# EAGLE design robot_balance (EAGLE 7.2.0)
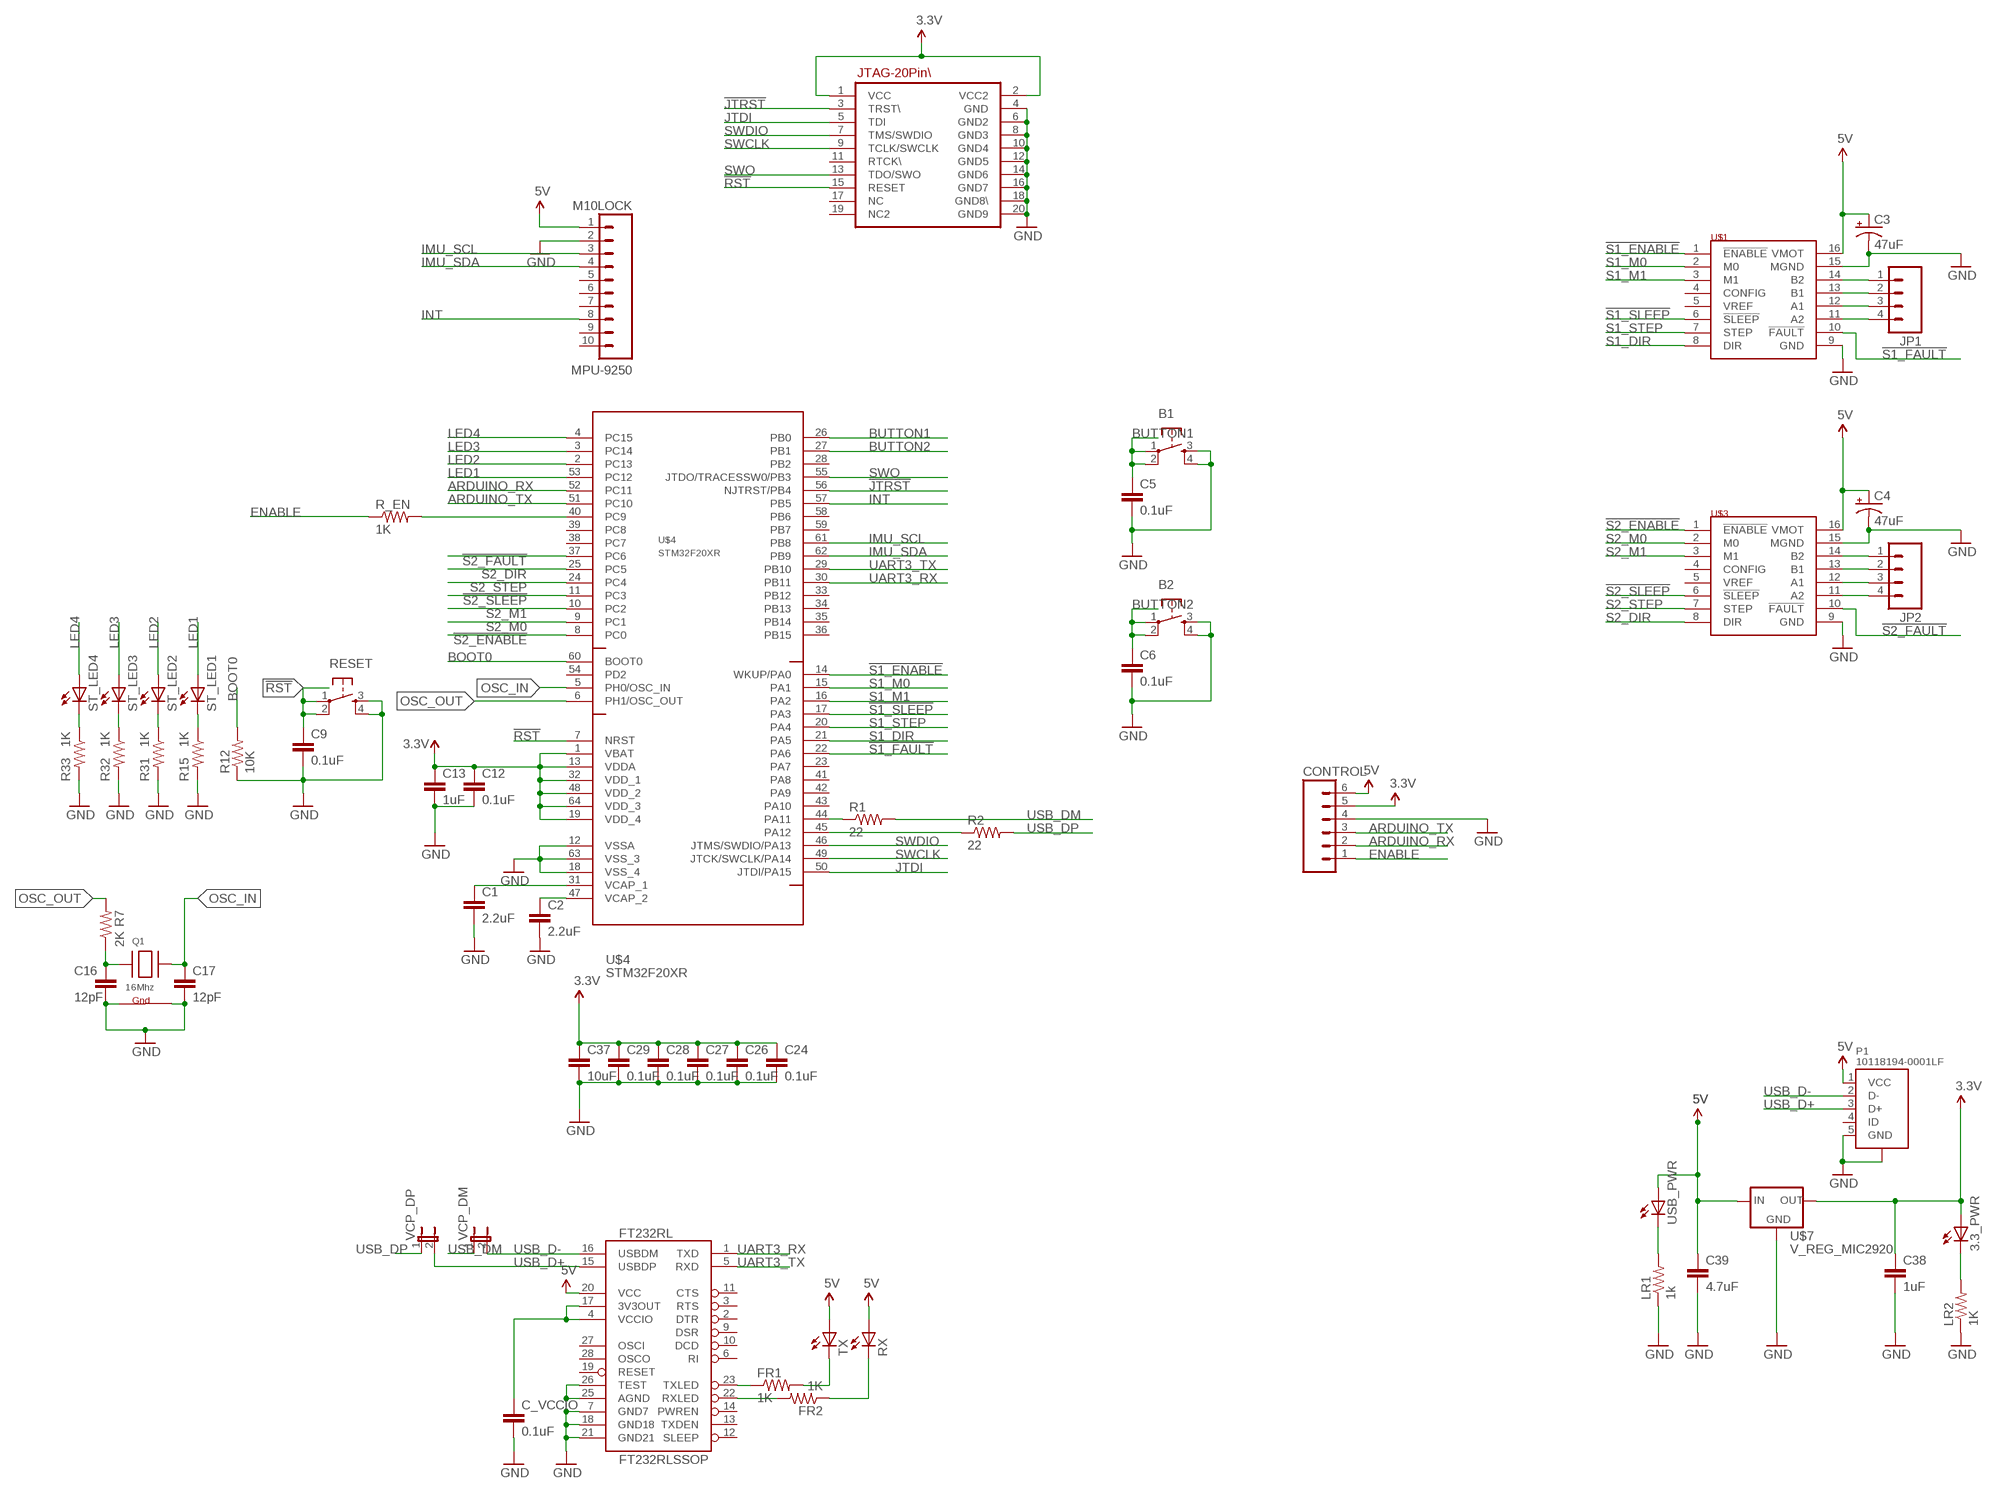
[diagram p0: schematic, sheet 1]

## Parts
3.3_PWR  LEDCHIPLED_0805  [CHIPLED_0805]
B1  TAC_SWITCHSMD  [TACTILE-SWITCH-SMD]
B2  TAC_SWITCHSMD  [TACTILE-SWITCH-SMD]
C1  2.2uF  2.2UF-25V-+80/-20(0805)  [0805]
C2  2.2uF  2.2UF-25V-+80/-20(0805)  [0805]
C3  47uF  47UF-10V-10%(TANT)  [EIA3528]
C4  47uF  47UF-10V-10%(TANT)  [EIA3528]
C5  0.1uF  2.2UF-25V-+80/-20(0805)  [0805]
C6  0.1uF  2.2UF-25V-+80/-20(0805)  [0805]
C9  0.1uF  2.2UF-25V-+80/-20(0805)  [0805]
C12  0.1uF  2.2UF-25V-+80/-20(0805)  [0805]
C13  1uF  2.2UF-25V-+80/-20(0805)  [0805]
C16  12pF  CAP0805  [0805]
C17  12pF  CAP0805  [0805]
C24  0.1uF  2.2UF-25V-+80/-20(0805)  [0805]
C26  0.1uF  2.2UF-25V-+80/-20(0805)  [0805]
C27  0.1uF  2.2UF-25V-+80/-20(0805)  [0805]
C28  0.1uF  2.2UF-25V-+80/-20(0805)  [0805]
C29  0.1uF  2.2UF-25V-+80/-20(0805)  [0805]
C37  10uF  2.2UF-25V-+80/-20(0805)  [0805]
C38  1uF  22UF-6.3V-20%(0805)  [0805]
C39  4.7uF  22UF-6.3V-20%(0805)  [0805]
C_VCCIO  0.1uF  CAP0603-CAP  [0603-CAP]
CONTROL  M06POLAR_LOCK  [MOLEX-1X6_LOCK]
FR1  1K  RESISTOR0603-RES  [0603-RES]
FR2  1K  RESISTOR0603-RES  [0603-RES]
FT232RL  FT232RLSSOP  [SSOP28DB]
JP1  M04POLAR_LOCK  [MOLEX-1X4_LOCK]
JP2  M04POLAR_LOCK  [MOLEX-1X4_LOCK]
LR1  1k  RESISTOR0805-RES  [0805]
LR2  1K  RESISTOR0805-RES  [0805]
MPU-9250  M10LOCK  [1X10_LOCK]
P1  10118194-0001LF  [10118194-0001LF]
Q1  16Mhz  XTAL-4-3225  [NX3225]
R1  22  RESISTOR0805-RES  [0805]
R2  22  RESISTOR0805-RES  [0805]
R7  2K  RESISTOR0805-RES  [0805]
R12  10K  RESISTOR0805-RES  [0805]
R15  1K  RESISTOR0805-RES  [0805]
R31  1K  RESISTOR0805-RES  [0805]
R32  1K  RESISTOR0805-RES  [0805]
R33  1K  RESISTOR0805-RES  [0805]
R_EN  1K  RESISTOR0603-RES  [0603-RES]
RESET  TAC_SWITCHSMD  [TACTILE-SWITCH-SMD]
RX  LEDCHIPLED_0805  [CHIPLED_0805]
ST_LED1  LEDCHIPLED_0805  [CHIPLED_0805]
ST_LED2  LEDCHIPLED_0805  [CHIPLED_0805]
ST_LED3  LEDCHIPLED_0805  [CHIPLED_0805]
ST_LED4  LEDCHIPLED_0805  [CHIPLED_0805]
TX  LEDCHIPLED_0805  [CHIPLED_0805]
U$1  POLOLU_DRV8834  [POLOLU_DRV8834]
U$2  JTAG_20PIN  [2X10]
U$3  POLOLU_DRV8834  [POLOLU_DRV8834]
U$4  STM32F20XR  [LQFP64]
U$7  V_REG_MIC2920  [SOT223]
USB_PWR  LEDCHIP-LED0805  [CHIP-LED0805]
VCP_DM  JUMPER-2SMD-NO  [SJ_2S-NO]
VCP_DP  JUMPER-2SMD-NO  [SJ_2S-NO]

## Nets
3.3V [power2]: 3.3_PWR.A C12.1 C13.1 C24.1 C26.1 C27.1 C28.1 C29.1 C37.1 C38.1 CONTROL.5 U$2.1(VCC) U$2.2(VCC2) U$4.1(VBAT) U$4.13(VDDA) U$4.19(VDD_4) U$4.32(VDD_1) U$4.48(VDD_2) U$4.64(VDD_3) U$7.3(OUT)
5V [power3]: C3.A(+) C4.A(+) C39.1 CONTROL.6 FT232RL.20(VCC) MPU-9250.1 P1.1(VCC) RX.A TX.A U$1.16(VMOT) U$3.16(VMOT) U$7.1(IN) USB_PWR.A
!JTRST: U$2.3(TRST\) U$4.56(NJTRST/PB4)
!RST: C9.1 RESET.1 RESET.2 U$2.15(RESET) U$4.7(NRST)
!S1_ENABLE: U$1.1(!ENABLE) U$4.14(WKUP/PA0)
!S1_FAULT: U$1.10(!FAULT) U$4.22(PA6)
!S1_SLEEP: U$1.6(!SLEEP) U$4.17(PA3)
!S2_ENABLE: U$3.1(!ENABLE) U$4.8(PC0)
!S2_FAULT: U$3.10(!FAULT) U$4.37(PC6)
!S2_SLEEP: U$3.6(!SLEEP) U$4.11(PC3)
ARDUINO_RX [data]: CONTROL.2 U$4.52(PC11)
ARDUINO_TX [data]: CONTROL.3 U$4.51(PC10)
BOOT0: R12.2 U$4.60(BOOT0)
BUTTON1: B1.1 B1.2 C5.1 U$4.26(PB0)
BUTTON2: B2.1 B2.2 C6.1 U$4.27(PB1)
ENABLE: CONTROL.1 R_EN.1
GND [power2]: B1.3 B1.4 B2.3 B2.4 C1.2 C2.2 C3.C(-) C4.C(-) C5.2 C6.2 C9.2 C12.2 C13.2 C16.2 C17.2 C24.2 C26.2 C27.2 C28.2 C29.2 C37.2 C38.2 C39.2 C_VCCIO.2 CONTROL.4 FT232RL.7(GND7) FT232RL.18(GND18) FT232RL.21(GND21) FT232RL.25(AGND) FT232RL.26(TEST) LR1.1 LR2.1 MPU-9250.2 P1.5(GND) P1.M1(SHIELD) P1.M2(SHIELD) P1.M3(SHIELD) P1.M4(SHIELD) Q1.2(G2) Q1.4(G1) R12.1 R15.2 R31.2 R32.2 R33.2 RESET.3 RESET.4 U$1.9(GND) U$1.15(MGND) U$2.4(GND) U$2.6(GND2) U$2.8(GND3) U$2.10(GND4) U$2.12(GND5) U$2.14(GND6) U$2.16(GND7) U$2.18(GND8\) U$2.20(GND9) U$3.9(GND) U$3.15(MGND) U$4.12(VSSA) U$4.18(VSS_4) U$4.63(VSS_3) U$7.2(GND)
IMU_SCL: MPU-9250.3 U$4.61(PB8)
IMU_SDA: MPU-9250.4 U$4.62(PB9)
INT: MPU-9250.8 U$4.57(PB5)
JTDI: U$2.5(TDI) U$4.50(JTDI/PA15)
LED1: ST_LED1.A U$4.53(PC12)
LED2: ST_LED2.A U$4.2(PC13)
LED3: ST_LED3.A U$4.3(PC14)
LED4: ST_LED4.A U$4.4(PC15)
N$1 [motor]: JP1.1 U$1.14(B2)
N$2: C1.1 U$4.31(VCAP_1)
N$3 [motor]: JP1.2 U$1.13(B1)
N$4 [motor]: JP1.3 U$1.12(A1)
N$5 [motor]: JP1.4 U$1.11(A2)
N$6: R_EN.2 U$4.40(PC9)
N$7: R1.1 U$4.44(PA11)
N$8 [data]: FR1.1 FT232RL.23(TXLED)
N$9 [data]: FR1.2 TX.C
N$10 [data]: FR2.2 FT232RL.22(RXLED)
N$11 [data]: FR2.1 RX.C
N$12: C2.1 U$4.47(VCAP_2)
N$13 [data]: C_VCCIO.1 FT232RL.4(VCCIO) FT232RL.17(3V3OUT)
N$14: R2.1 U$4.45(PA12)
N$18 [data]: 3.3_PWR.C LR2.2
N$19 [data]: LR1.2 USB_PWR.C
N$21 [motor]: JP2.1 U$3.14(B2)
N$23 [motor]: JP2.2 U$3.13(B1)
N$24 [motor]: JP2.3 U$3.12(A1)
N$25 [motor]: JP2.4 U$3.11(A2)
N$41 [data]: R15.1 ST_LED1.C
N$43 [data]: R31.1 ST_LED2.C
N$45: R32.1 ST_LED3.C
N$47 [data]: R33.1 ST_LED4.C
N$122: C16.1 Q1.1(X1) R7.1
OSC_IN: C17.1 Q1.3(X2) U$4.5(PH0/OSC_IN)
OSC_OUT: R7.2 U$4.6(PH1/OSC_OUT)
S1_DIR: U$1.8(DIR) U$4.21(PA5)
S1_M0: U$1.2(M0) U$4.15(PA1)
S1_M1: U$1.3(M1) U$4.16(PA2)
S1_STEP: U$1.7(STEP) U$4.20(PA4)
S2_DIR: U$3.8(DIR) U$4.25(PC5)
S2_M0: U$3.2(M0) U$4.9(PC1)
S2_M1: U$3.3(M1) U$4.10(PC2)
S2_STEP: U$3.7(STEP) U$4.24(PC4)
SWCLK: U$2.9(TCLK/SWCLK) U$4.49(JTCK/SWCLK/PA14)
SWDIO: U$2.7(TMS/SWDIO) U$4.46(JTMS/SWDIO/PA13)
SWO: U$2.13(TDO/SWO) U$4.55(JTDO/TRACESSW0/PB3)
UART3_RX: FT232RL.1(TXD) U$4.30(PB11)
UART3_TX: FT232RL.5(RXD) U$4.29(PB10)
USB_D+ [data]: FT232RL.15(USBDP) P1.3(D+) VCP_DP.2
USB_D- [data]: FT232RL.16(USBDM) P1.2(D-) VCP_DM.2
USB_DM: R1.2 VCP_DM.1
USB_DP: R2.2 VCP_DP.1
Unconnected: FT232RL.2(DTR) FT232RL.3(RTS) FT232RL.6(RI) FT232RL.9(DSR) FT232RL.10(DCD) FT232RL.11(CTS) FT232RL.12(SLEEP) FT232RL.13(TXDEN) FT232RL.14(PWREN) FT232RL.19(RESET) FT232RL.27(OSCI) FT232RL.28(OSCO) MPU-9250.5 MPU-9250.6 MPU-9250.7 MPU-9250.9 MPU-9250.10 P1.4(ID) U$1.4(CONFIG) U$1.5(VREF) U$2.11(RTCK\) U$2.17(NC) U$2.19(NC2) U$3.4(CONFIG) U$3.5(VREF) U$4.23(PA7) U$4.28(PB2) U$4.33(PB12) U$4.34(PB13) U$4.35(PB14) U$4.36(PB15) U$4.38(PC7) U$4.39(PC8) U$4.41(PA8) U$4.42(PA9) U$4.43(PA10) U$4.54(PD2) U$4.58(PB6) U$4.59(PB7)

## Library data of the parts
3.3_PWR RX ST_LED1-ST_LED4 TX USB_PWR = adafruit:LED: LED OSRAM: - CHIPLED LG R971, LG N971, LY N971, LG Q971, LY Q971, LO R971, LY R971 LH N974, LH R974 LS Q976, LO Q976, LY Q976 LO Q996 - Hyper CHIPLED LW Q18S LB Q993, LB Q99A, LB R99A - SideLED LS A670, LO A670, LY A670, LG A670, LP A670 LB A673, LV A673, LT A673, LW A673 LH A674 LY A675 LS A676, LA A676, LO A676, LY A676, LW A676 LS A679, LY A679, LG A679 - Hyper Micro SIDELED® LS Y876, LA Y876, LO Y876, LY Y876 LT Y87S - SmartLED LW L88C, LW L88S LB L89C, LB L89S, LG L890 LS L89K, LO L89K, LY L89K LS L896, LA L896, LO L896, LY L896 - TOPLED LS T670, LO T670, LY T670, LG T670, LP T670 LSG T670, LSP T670, LSY T670, LOP T670, LYG T670 LG T671, LOG T671, LSG T671 LB T673, LV T673, LT T673, LW T673 LH T674 LS T676, LA T676, LO T676, LY T676, LB T676, LH T676, LSB T676, LW T676 LB T67C, LV T67C, LT T67C, LS T67K, LO T67K, LY T67K, LW E67C LS E67B, LA E67B, LO E67B, LY E67B, LB E67C, LV E67C, LT E67C LW T67C LS T679, LY T679, LG T679 LS T770, LO T770, LY T770, LG T770, LP T770 LB T773, LV T773, LT T773, LW T773 LH T774 LS E675, LA E675, LY E675, LS T675 LS T776, LA T776, LO T776, LY T776, LB T776 LHGB T686 LT T68C, LB T68C - Hyper Mini TOPLED® LB M676 - Mini TOPLED Santana® LG M470 LS M47K, LO M47K, LY M47K Source: http://www.osram.convergy.de/
B1 B2 RESET = SparkFun-Electromechanical:TAC_SWITCH: Momentary Switch Button commonly used for reset or general input. Spark Fun Electronics SKU : COM-00097 SMT- SWCH-08247
C1 C2 = SparkFun-Capacitors:2.2UF-25V-+80/-20(0805): CAP-11624; PROD_ID: CAP-11624
C3 C4 = SparkFun-Capacitors:47UF-10V-10%(TANT): CAP-08310 47uF Tantalum SMT 10V 10% (EIA-3528); PROD_ID: CAP-08310
C5 C6 C9 C12 C13 C24 C26-C29 C37 = SparkFun-Capacitors:2.2UF-25V-+80/-20(0805): CAP-11624; PROD_ID: CAP-11624; VALUE: 2.2uF
C16 C17 C_VCCIO = SparkFun-Capacitors:CAP: Capacitor Standard 0603 ceramic capacitor, and 0.1" leaded capacitor.
C38 C39 = SparkFun-Capacitors:22UF-6.3V-20%(0805): CAP-08402 Ceramic; PROD_ID: CAP-08402; VALUE: 22uF
CONTROL = SparkFun-Connectors:M06: Header 6 Standard 6-pin 0.1" header. Use with straight break away headers (SKU : PRT-00116), right angle break away headers (PRT-00553), swiss pins (PRT-00743), machine pins (PRT-00117), and female headers (PRT-00115). Molex polarized connector foot print use with SKU : PRT-08094 with associated crimp pins and housings. NOTES ON THE VARIANTS LOCK and LOCK_LONGPADS... This footprint was designed to help hold the alignment of a through-hole component (i.e. 6-pin header) while soldering it into place. You may notice that each hole has been shifted either up or down by 0.005 of an inch from it's more standard position (which is a perfectly straight line). This slight alteration caused the pins (the squares in the middle) to touch the edges of the holes. Because they are alternating, it causes a "brace" to hold the component in place. 0.005 has proven to be the perfect amount of "off-center" position when using our standard breakaway headers. Although looks a little odd when you look at the bare footprint, once you have a header in there, the alteration is very hard to notice. Also,if you push a header all the way into place, it is covered up entirely on the bottom side. This idea of altering the position of holes to aid alignment will be further integrated into the Sparkfun Library for other footprints. It can help hold any component with 3 or more connection pins.
FR1 FR2 R1 R2 R12 R_EN = SparkFun-Passives:RESISTOR: Resistor Basic schematic elements and footprints for 0603, 1206, and PTH resistors.
FT232RL = SparkFun-DigitalIC:FT232RL: USB UART FT232RL 4th Generation USB UART (USB <-> Serial) Controller. Spark Fun Electronics SKU : COM-00650 Production SKU IC-00870; PROD_ID: IC-00870
JP1 JP2 = SparkFun-Connectors:M04: Header 4 Standard 4-pin 0.1" header. Use with straight break away headers (SKU : PRT-00116), right angle break away headers (PRT-00553), swiss pins (PRT-00743), machine pins (PRT-00117), and female headers (PRT-00115). Molex polarized connector foot print use with SKU : PRT-08231 with associated crimp pins and housings. 1MM SMD Version SKU: PRT-10208
LR1 LR2 R7 R15 R31-R33 = SparkFun-Resistors:RESISTOR: Resistor Basic schematic elements and footprints for 0603, 1206, and PTH resistors.
MPU-9250 = SparkFun-Connectors:M10: Header 10 Standard 10-pin 0.1" header. Use with straight break away headers (SKU : PRT-00116), right angle break away headers (PRT-00553), swiss pins (PRT-00743), machine pins (PRT-00117), and female headers (PRT-00115).
P1 = usb_micro:10118194-0001LF: CONN USB MICRO B RECPT SMT R/A; DISTPARTNO: 609-4618-1-ND; DISTRIBUTOR: Digikey; MANPARTNO: 10118194-0001LF; MANUFACTURER: FCI; PARTNO: GT10040; POPULATE: yes
Q1 = adafruit:XTAL-4: Classic 4-pin 3.2 x 2.5mm crystal
U$1 U$3 = pololu:POLOLU_DRV8834
U$2 = JonathanLukas:JTAG_20PIN
U$4 = stm32F:STM32F20XR
U$7 = SparkFun-PowerIC:V_REG_MIC2920: MIC2920A (http://www.micrel.com/_PDF/mic2920.pdf) - 400mA output LDO Regulator
VCP_DM VCP_DP = SparkFun-Retired:JUMPER-2: Jumper Basic 0.1" spaced jumper. Use with breakaway headers.

## Net classes
0 default: width 0.203 mm
1 data: width 0.152 mm
2 power: width 0.635 mm, clearance 0.152 mm
3 power2: width 0.305 mm, clearance 0.152 mm
4 motor: width 0.813 mm
5 power3: width 0.457 mm

## Board
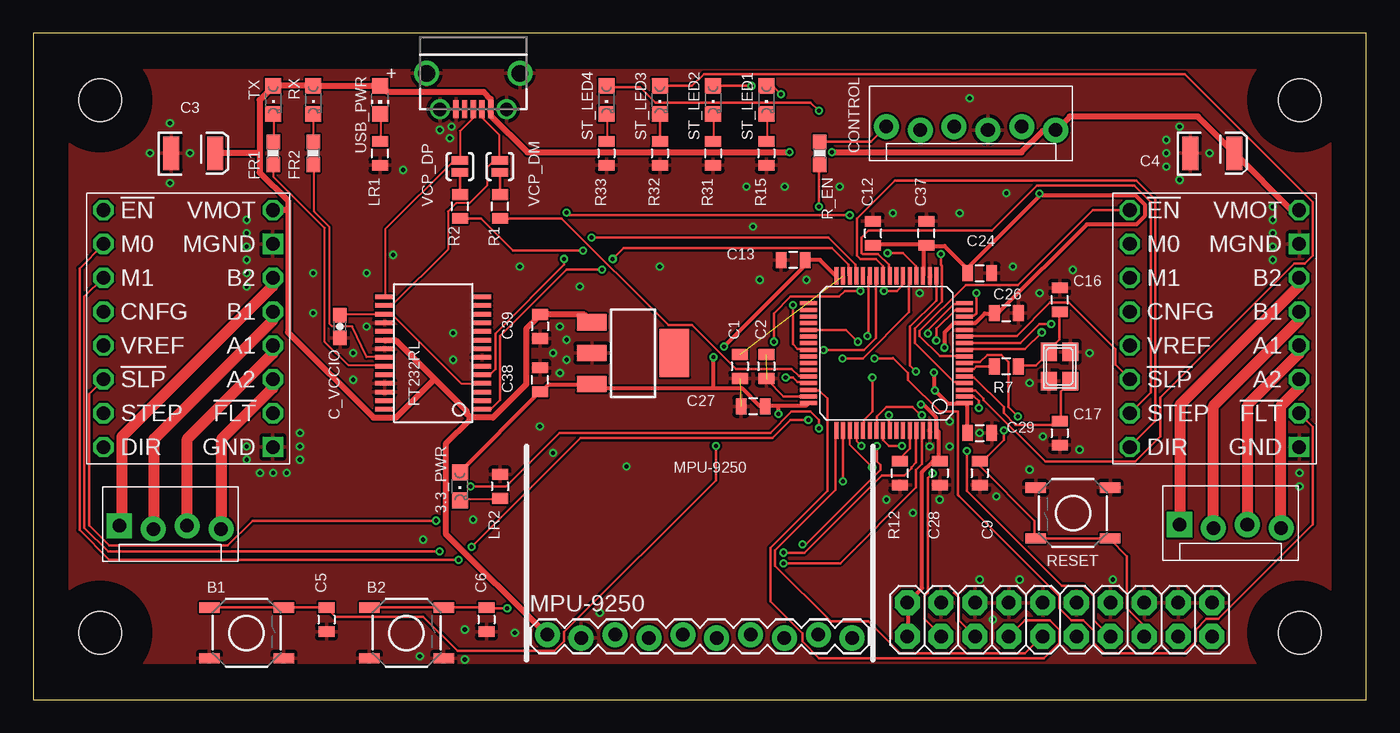
[diagram p1: board, top side]
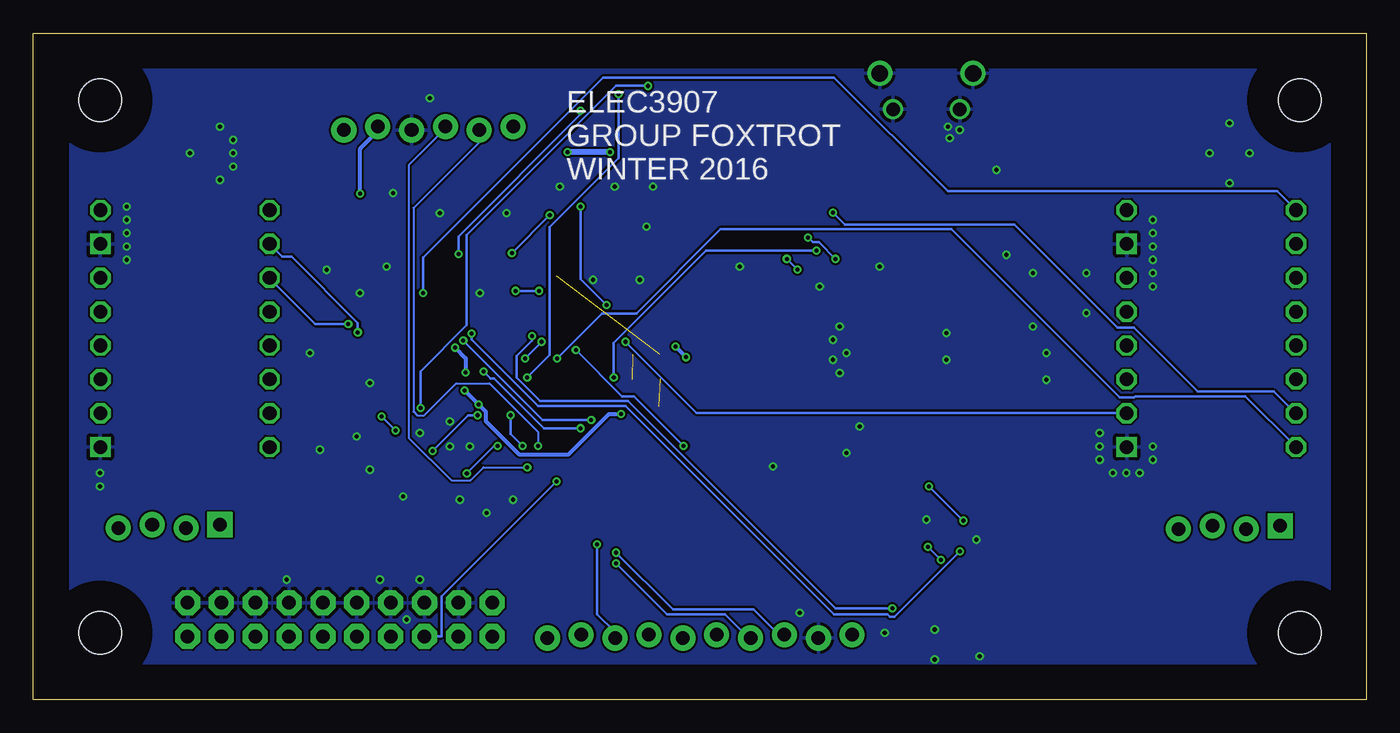
[diagram p2: board, bottom side, seen from below]

Size 100 x 50 mm. Coordinates in mm from the lower left corner, seen from the top.
Outline: 0,0 100,0 100,50 0,50 0,0
Copper layers (1*16): Top 0.035mm / dielectric 1.5mm / Bottom 0.035mm
Design rules "ITEADstudio_DRC *": minimum track width 6mil, minimum drill 12mil, track to track 6mil, track to pad 6mil, pad to pad 6mil, via to via 6mil, smd to smd 0mil, copper to edge 10mil, drill to drill 10mil, minimum pad ring 5mil, minimum via ring 6mil, stop-mask expansion 2mil, vias tented up to drill 100mil, thermal gap 10mil
Holes 3.2 mm at 5,5 5,45 95,45 95,5
tKeepout: area 3,43 to 7,47; area 93,43 to 97,47; area 93,3 to 97,7; area 3,3 to 7,7
bKeepout: area 3,43 to 7,47; area 93,43 to 97,47; area 93,3 to 97,7; area 3,3 to 7,7
tRestrict: area 3,43 to 7,47; area 93,43 to 97,47; area 93,3 to 97,7; area 3,3 to 7,7; area 1,1 to 99,49
bRestrict: area 3,43 to 7,47; area 93,43 to 97,47; area 93,3 to 97,7; area 3,3 to 7,7; area 1,1 to 99,49

### Footprints (pad centres in the part's own frame; a part is rotated, then mirrored left to right if it is on the bottom)
CHIPLED_0805 = smd 1.2 x 1.2: A 0,-1.05; C 0,1.05
TACTILE-SWITCH-SMD = smd 1.524 x 0.762: 1 -2.794,1.905; 2 2.794,1.905; 3 -2.794,-1.905; 4 2.794,-1.905
0805 = smd 0.8 x 1.2: 1 -0.9,0; 2 0.9,0
EIA3528 = smd 1.2 x 2.5: A 1.65,0; C -1.65,0
0603-CAP = smd 1.1 x 1: 1 -0.85,0; 2 0.85,0
MOLEX-1X6_LOCK = drill 1.016 pad 1.88: 1 0,0; 2 2.54,-0.254; 3 5.08,0; 4 7.62,-0.254; 5 10.16,0; 6 12.7,-0.254
0603-RES = smd 1.1 x 1: 1 -0.85,0; 2 0.85,0
SSOP28DB = smd 0.348 x 1.397: 1 -4.225,-3.656; 2 -3.575,-3.656; 3 -2.925,-3.656; 4 -2.275,-3.656; 5 -1.625,-3.656; 6 -0.975,-3.656; 7 -0.325,-3.656; 8 0.325,-3.656; 9 0.975,-3.656; 10 1.625,-3.656; 11 2.275,-3.656; 12 2.925,-3.656; 13 3.575,-3.656; 14 4.225,-3.656; 15 4.225,3.656; 16 3.575,3.656; 17 2.925,3.656; 18 2.275,3.656; 19 1.625,3.656; 20 0.975,3.656; 21 0.325,3.656; 22 -0.325,3.656; 23 -0.975,3.656; 24 -1.625,3.656; 25 -2.275,3.656; 26 -2.925,3.656; 27 -3.575,3.656; 28 -4.225,3.656
MOLEX-1X4_LOCK = drill 1.016 pad 1.88 square: 1 0,0.127 | drill 1.016 pad 1.88: 2 2.54,-0.127; 3 5.08,0.127; 4 7.62,-0.127
1X10_LOCK = drill 1.016 pad 1.88: 1 0,0.127; 2 2.54,-0.127; 3 5.08,0.127; 4 7.62,-0.127; 5 10.16,0.127; 6 12.7,-0.127; 7 15.24,0.127; 8 17.78,-0.127; 9 20.32,0.127; 10 22.86,-0.127
10118194-0001LF = smd 0.4 x 1.35: 1 -1.3,2.7; 2 -0.65,2.7; 3 0,2.7; 4 0.65,2.7; 5 1.3,2.7 | drill 1: M1 -2.5,2.7; M2 2.5,2.7 | drill 1.25: M3 -3.5,0; M4 3.5,0
NX3225 = smd 1.4 x 1.2: 1 -1.1,-0.8; 2 1.1,-0.8; 3 1.1,0.8; 4 -1.1,0.8
POLOLU_DRV8834 = drill 1.016 octagon: 1 1.27,-1.27; 2 1.27,-3.81; 3 1.27,-6.35; 4 1.27,-8.89; 5 1.27,-11.43; 6 1.27,-13.97; 7 1.27,-16.51; 8 1.27,-19.05; 10 13.97,-16.51; 11 13.97,-13.97; 12 13.97,-11.43; 13 13.97,-8.89; 14 13.97,-6.35; 16 13.97,-1.27 | drill 1.016 square: 9 13.97,-19.05; 15 13.97,-3.81
2X10 = drill 1.016 pad 1.88 octagon: 1 -11.43,-1.27; 2 -11.43,1.27; 3 -8.89,-1.27; 4 -8.89,1.27; 5 -6.35,-1.27; 6 -6.35,1.27; 7 -3.81,-1.27; 8 -3.81,1.27; 9 -1.27,-1.27; 10 -1.27,1.27; 11 1.27,-1.27; 12 1.27,1.27; 13 3.81,-1.27; 14 3.81,1.27; 15 6.35,-1.27; 16 6.35,1.27; 17 8.89,-1.27; 18 8.89,1.27; 19 11.43,-1.27; 20 11.43,1.27
LQFP64 = smd 1.3 x 0.3: 1 -5.85,3.75; 2 -5.85,3.25; 3 -5.85,2.75; 4 -5.85,2.25; 5 -5.85,1.75; 6 -5.85,1.25; 7 -5.85,0.75; 8 -5.85,0.25; 9 -5.85,-0.25; 10 -5.85,-0.75; 11 -5.85,-1.25; 12 -5.85,-1.75; 13 -5.85,-2.25; 14 -5.85,-2.75; 15 -5.85,-3.25; 16 -5.85,-3.75; 33 5.85,-3.75; 34 5.85,-3.25; 35 5.85,-2.75; 36 5.85,-2.25; 37 5.85,-1.75; 38 5.85,-1.25; 39 5.85,-0.75; 40 5.85,-0.25; 41 5.85,0.25; 42 5.85,0.75; 43 5.85,1.25; 44 5.85,1.75; 45 5.85,2.25; 46 5.85,2.75; 47 5.85,3.25; 48 5.85,3.75 | smd 0.3 x 1.3: 17 -3.75,-5.8; 18 -3.25,-5.8; 19 -2.75,-5.8; 20 -2.25,-5.8; 21 -1.75,-5.8; 22 -1.25,-5.8; 23 -0.75,-5.8; 24 -0.25,-5.8; 25 0.25,-5.8; 26 0.75,-5.8; 27 1.25,-5.8; 28 1.75,-5.8; 29 2.25,-5.8; 30 2.75,-5.8; 31 3.25,-5.8; 32 3.75,-5.8; 49 3.75,5.8; 50 3.25,5.8; 51 2.75,5.8; 52 2.25,5.8; 53 1.75,5.8; 54 1.25,5.8; 55 0.75,5.8; 56 0.25,5.8; 57 -0.25,5.8; 58 -0.75,5.8; 59 -1.25,5.8; 60 -1.75,5.8; 61 -2.25,5.8; 62 -2.75,5.8; 63 -3.25,5.8; 64 -3.75,5.8
SOT223 = smd 1.219 x 2.235: 1 -2.311,-3.099; 2 0,-3.099; 3 2.311,-3.099 | smd 3.6 x 2.2: 4 0,3.099
CHIP-LED0805 = smd 1.2 x 1.2: A 0,-1.05; C 0,1.05
SJ_2S-NO = smd 0.635 x 1.27: 1 -0.45,0; 2 0.45,0

### Placement (x,y rotation side)
3.3_PWR  32,16 180 top
B1  16,5 0 top
B2  28,5 0 top
C1  53,25 270 top
C2  55,25 270 top
C3  12,41 0 top
C4  88.46,41 0 top
C5  22,6 270 top
C6  34,6 270 top
C9  71,17 270 top
C12  63,35 90 top
C13  57,33 180 top
C16  77,30 90 top
C17  77,20 270 top
C24  71,32 0 top
C26  73,29 0 top
C27  54,22 180 top
C28  68,17 270 top
C29  71,20 0 top
C37  67,35 90 top
C38  38,24 90 top
C39  38,28 270 top
C_VCCIO  23,28 270 top
CONTROL  64,43 0 top
FR1  18,41 90 top
FR2  21,41 270 top
FT232RL  30,26 90 top
JP1  6.46,12.92 0 top
JP2  86,13 0 top
LR1  26,41 90 top
LR2  35,16 270 top
MPU-9250  38.57,4.74 0 top
P1  33,47 180 top
Q1  77,25 270 top
R1  35,37 90 top
R2  32,37 90 top
R7  73,25 180 top
R12  65,17 90 top
R15  55,41 270 top
R31  51,41 270 top
R32  47,41 270 top
R33  43,41 270 top
R_EN  59,41 270 top
RESET  78,14 180 top
RX  21,45 180 top
ST_LED1  55,45 180 top
ST_LED2  51,45 180 top
ST_LED3  47,45 180 top
ST_LED4  43,45 180 top
TX  18,45 180 top
U$1  4,38 0 top
U$2  77,6 0 top
U$3  81,38 0 top
U$4  64,26 180 top
U$7  45,26 270 top
USB_PWR  26,45 180 top
VCP_DM  35,40 90 top
VCP_DP  32,40 90 top

### Tracks (layer width: path | path; a pad name or v marks a point on that pad's centre or on a via)
3.3V  (via drill 0.3)
  Top 0.305: U$4.32 60.19,31.83 59.03,32.98 57.96,32.98 C13.1 57.87,32.89 57.87,32.54 v51.83,26.49 | 55.92,22.05 57.96,22.05 58.14,22.23 U$4.48 | 55.92,22.05 54.94,22.05 C27.1 54.76,22.05 54.5,22.05 53.16,23.38 51.03,23.38 | 3.3_PWR.A 32,17.07 37.96,23.02 C38.1 38.14,23.11 38.67,23.65 41.87,23.65 U$7.3 42.05,23.65 42.32,23.38 51.03,23.38 | 51.03,23.38 v51.03,25.69 | C29.1 70.05,20 70.05,22.05 69.88,22.23 U$4.1 69.79,22.23 68.63,22.23 v67.65,23.2 67.56,23.29 v67.56,24.54 | v66.59,22.14 66.76,22.14 67.74,21.16 67.74,20.36 U$4.64 67.83,20.18 67.92,20.09 67.92,17.96 C28.1 67.83,17.87 67.47,17.87 66.67,17.07 66.67,8.36 65.61,7.29 U$2.2 65.61,7.2 65.61,4.8 U$2.1 | C12.1 63.03,34.14 66.94,34.14 C37.1 | C37.1 67.12,34.05 68.36,34.05 70.05,32.36 70.05,32 C24.1 70.14,32.45 75.56,37.87 | U$4.19 66.76,31.83 66.76,34.05 C37.1 | 75.56,37.87 82.68,37.87 83.39,37.16 83.39,36.27 82.77,35.65 79.03,35.65 72.45,29.07 72.19,29.07 C26.1 72.1,28.98 71.39,28.98 70.67,28.27 69.88,28.27 U$4.13 69.79,28.27 69.08,28.27 68.36,27.56 v68.36,26.4 | v75.48,37.96 75.56,37.87 | v55.92,21.43 55.92,22.05
  Bottom 0.305: v51.03,25.69 v51.83,26.49 | v67.65,23.2 v66.59,22.14 66.05,21.6 66.05,20.89 63.56,18.4 59.83,18.4 56.81,21.43 v55.92,21.43 | v75.48,37.96 75.48,41.34 74.23,42.58 74.23,42.94 CONTROL.5 | v67.56,24.54 67.56,25.6 v68.36,26.4
5V  (via drill 0.3)
  Top 0.457: U$7.1 41.87,28.36 41.34,28.89 38.05,28.89 C39.1 37.87,28.71 36.98,27.83 36.98,23.65 34.49,21.16 32.8,21.16 | 30.09,24.05 32.54,21.6 32.54,21.43 32.8,21.16 | 30.09,24.05 27.2,26.94 26.4,26.94 FT232RL.20 | MPU-9250.1 38.49,4.89 30.94,12.45 30.94,19.2 32.72,20.98 32.8,21.16 | v59.92,41.07 74.14,41.07 75.74,42.67 76.63,42.67 CONTROL.6 76.88,42.88 77.75,43.75 87.38,43.75 90,41.12 C4.A 90.12,41 94.38,36.75 94.88,36.75 U$3.16 | v56.72,41.07 37.07,41.07 34.31,43.83 34.31,44.09 P1.1 34.31,44.36 34.31,45.07 33.78,45.61 26.58,45.61 26.23,45.96 USB_PWR.A 25.96,46.05 21.16,46.05 RX.A 20.98,46.05 18.05,46.05 TX.A 17.87,45.87 16.98,44.98 16.98,41 | 30.09,24.05 27.2,21.16 25.51,21.16 19.11,27.56 19.11,36.75 | 19.11,36.75 19.11,37.43 16.98,39.56 16.98,41 | 16.98,41 C3.A | 19.11,36.75 18,36.75 U$1.16
  Bottom 0.457: v56.72,41.07 v59.92,41.07
!JTRST  (via drill 0.3)
  Top 0.203: v65.16,19.02 64.19,19.02 63.74,19.47 63.74,20.18 U$4.56 | v67.47,16.98 67.12,16.62 67.12,8 66.85,7.73 66.85,6.04 68.1,4.8 U$2.3
  Bottom 0.203: v65.16,19.02 65.43,19.02 v67.47,16.98
!RST  (via drill 0.3)
  Top 0.203: v73.88,21.25 73.17,21.96 73.17,25.34 72.63,25.87 71.56,25.87 71.03,25.34 69.88,25.34 U$4.7 | v72.81,20.18 72.81,19.47 71.12,17.78 C9.1 71.03,17.87 71.03,17.51 75.12,13.42 75.12,12.18 RESET.2 75.3,12.09 80.72,12.09 RESET.1 80.81,12 82.06,10.76 82.06,6.84 83.3,5.6 83.3,4.8 U$2.15
  Bottom 0.203: v72.81,20.18 v73.88,21.25
!S1_ENABLE  (via drill 0.3)
  Top 0.203: v70.76,30.49 70.76,28.98 70.59,28.8 69.88,28.8 U$4.14
  Bottom 0.203: v70.76,30.49 70.76,33.16 57.25,46.67 39.92,46.67 31.38,38.14 6.67,38.14 5.33,36.8 U$1.1
!S1_FAULT  (via drill 0.3)
  Top 0.203: v63.83,30.67 64.81,30.67 65.16,31.03 65.16,31.74 U$4.22 | v62.05,30.67 60.9,30.67 60.45,30.23 56.81,30.23 55.56,28.98 v55.56,26.85
  Bottom 0.203: v62.05,30.67 v63.83,30.67 | v55.56,26.85 50.23,21.51 18.05,21.51 U$1.10
!S1_SLEEP  (via drill 0.3)
  Top 0.203: v66.23,24.62 65.79,25.07 65.79,28 67.74,29.96 67.74,31.74 U$4.17 | v58.94,20.36 58.94,20.98 58.32,21.6 56.9,21.6 55.3,20 39.47,20 35.47,16 v32.8,16 | v30.23,13.42 16.45,13.42 14.58,11.56 5.69,11.56 4.18,13.07 4.18,22.94 5.25,24 U$1.6
  Bottom 0.203: v66.23,24.62 65.7,24.09 65.43,24.09 61.7,20.36 v58.94,20.36 | v30.23,13.42 v32.8,16
!S2_ENABLE
  Top 0.203: U$4.8 69.79,25.78 68.01,25.78 66.5,27.29 66.5,27.65 69.96,31.11 73.88,31.11 79.48,36.72 82.23,36.72 U$3.1
!S2_FAULT  (via drill 0.3)
  Top 0.203: v61.87,26.85 60.98,27.74 58.23,27.74 U$4.37 | v63.12,25.6 64.45,25.6 64.5,25.62 65.62,24.5 65.62,24 68,21.62 69.38,21.62 69.38,15.38 69.43,15.29 76.99,7.73 76.99,6.84 77.88,5.96 78.77,5.96 79.57,5.16 79.57,4.27 80.37,3.47 86.32,3.47 87.21,4.36 87.21,5.25 88.01,6.04 88.9,6.04 96.01,13.16 96.01,20.45 95.03,21.43 U$3.10
  Bottom 0.203: v63.12,25.6 v61.87,26.85
!S2_SLEEP
  Top 0.203: U$4.11 69.88,27.29 73.79,27.29 76.28,29.78 77.7,29.78 81.17,26.31 81.17,25.16 82.23,24.09 U$3.6
ARDUINO_RX  (via drill 0.3)
  Top 0.152: v62.14,19.02 61.78,19.38 61.78,20.18 U$4.52
  Bottom 0.152: v62.14,19.02 62.14,20.09 65.79,23.74 68.28,23.74 70.67,21.34 71.21,21.34 71.48,21.6 71.48,36.89 66.5,41.87 66.5,42.67 CONTROL.2
ARDUINO_TX  (via drill 0.3)
  Top 0.152: v62.94,17.42 61.25,19.11 61.25,20.18 U$4.51
  Bottom 0.152: v62.94,17.42 66.23,17.42 67.21,16.45 68.63,16.45 71.83,19.65 71.83,40.09 69.16,42.76 69.16,42.94 CONTROL.3
BOOT0
  Top 0.203: R12.2 65.08,17.96 65.08,18.14 65.79,18.85 65.79,20.18 U$4.60
BUTTON1  (via drill 0.3)
  Top 0.203: v59.3,26.23 62.32,26.23 63.21,27.11 63.21,31.74 U$4.26 | v51.21,19.02 51.21,16.45 39.83,5.07 39.83,4.36 39.12,3.65 31.83,3.65 29.25,6.22 22.67,6.22 22.05,6.84 C5.1 21.96,6.93 18.85,6.93 B1.2 18.76,6.93 13.25,6.93 B1.1
  Bottom 0.203: v59.3,26.23 55.83,22.76 54.94,22.76 v51.21,19.02
BUTTON2  (via drill 0.3)
  Top 0.203: v62.59,27.29 62.67,27.38 62.67,31.74 U$4.27 | v35.56,6.84 34.05,6.84 C6.1 33.96,6.93 30.85,6.93 B2.2 30.76,6.93 25.25,6.93 B2.1
  Bottom 0.203: v62.59,27.29 62.59,26.94 63.74,25.78 63.74,24.18 61.96,22.4 55.38,22.4 39.83,6.84 v35.56,6.84
ENABLE
  Top 0.203: R_EN.1 59.03,41.87 62.85,41.87 63.92,42.94 CONTROL.1
GND  (via drill 0.3)  (1 unrouted)
  other vias: 66.5,30.5 64.5,36.5 75.5,30.5 73.5,32.5 54.5,31.5 53.5,38.5 60.5,38.5 69.5,36.5 73,38 38,20.5 47,32.5 36.5,32.5 41,31 40,27 40,25.5 39.5,24.5 39,26 39.5,28 54,35.5 58,31.5 44.5,17.5 39,18.5 33,13.5 25,32 24,26 24,24 21,29 21,32 25,28 31.5,25.5 31.5,27.5 10.25,43.25 11.75,41 8.75,41 27.75,39.75 10.25,38.75 67.25,19 68,15 66,14 64,15 72.25,15.25 71,20 74.75,17.25 78.5,18.75 79.25,26 74.75,23.75 78,32.25 75.75,19.75 68.75,19 68.75,20.88 36.12,5 32.38,3 29,3.25 32.38,5.25 29.25,12 17,17 20,20 20,19 20,18 18,17 19,17 16,18 16,19 16,33 16,34 16,35 16,36 16,31 16,32 95,17 95,16 93,35 93,34 93,33 93,36 93,37 86,43 85,42 85,41 85,40 86,39 70.25,45.12 88.25,41 56.38,38.5 27,33.38 42.5,6.5 81,9 72,6 71,9 74,9 31.38,43 30.5,42.75 31.25,42.12
  pour Top: 1,49 99,49 99,1 1,1
  pour Bottom: 2,48 98,48 98,2 2,2
IMU_SCL  (via drill 0.3)
  Top 0.203: v56.27,11.02 57.87,11.02 63.65,16.8 65.34,16.8 65.88,17.34 65.88,17.42 66.23,17.78 66.23,20.18 U$4.61
  Bottom 0.203: v56.27,11.02 52.01,6.76 45.96,6.76 44.09,4.89 43.74,4.89 MPU-9250.3
IMU_SDA  (via drill 0.3)
  Top 0.203: v56.27,10.22 60.54,10.22 66.23,15.91 66.23,17.25 66.67,17.69 66.67,20.18 U$4.62
  Bottom 0.203: v56.27,10.22 52.45,6.4 48.09,6.4 46.23,4.53 MPU-9250.4
INT  (via drill 0.3)
  Top 0.203: v64.19,21.34 64.19,20.27 U$4.57 | v63.3,19.02 63.3,17.87 63.56,17.6 63.56,17.25 57.96,11.65 v57.7,11.65
  Bottom 0.203: v64.19,21.34 64.19,19.91 v63.3,19.02 | v57.7,11.65 57.7,6.4 56.36,5.07 56.36,4.62 MPU-9250.8
JTDI  (via drill 0.3)
  Top 0.203: 69.08,8 69.43,7.64 69.43,5.96 70.59,4.8 U$2.5 | 60.81,20.27 U$4.50 v60.75,16.38
  Bottom 0.203: v60.75,16.38 69.38,7.75 69.38,4.75 70.62,4.75 U$2.5
LED1  (via drill 0.3)
  Top 0.203: v56.1,45.43 55.56,45.96 55.03,45.96 ST_LED1.A | v62.94,24.18 62.94,21.6 62.32,20.98 62.32,20.27 U$4.53
  Bottom 0.203: v56.1,45.43 56.1,40.63 61.25,35.47 61.25,25.87 v62.94,24.18
LED2  (via drill 0.3)
  Top 0.203: v53.87,46.05 51.03,46.05 ST_LED2.A | v70.94,21.87 70.94,22.4 70.59,22.76 69.88,22.76 U$4.2
  Bottom 0.203: v53.87,46.05 56.27,46.05 67.47,34.85 67.47,28.09 70.94,24.62 v70.94,21.87
LED3
  Top 0.203: ST_LED3.A 47.03,46.05 49.43,46.05 50.32,46.94 86.41,46.94 96.01,37.34 96.01,33.34 95.39,32.72 94.59,32.72 84.54,22.67 84.54,19.74 82.68,17.87 75.92,17.87 71.3,22.49 71.3,22.58 70.67,23.2 69.88,23.2 U$4.3
LED4  (via drill 0.3)
  Top 0.203: v58.94,44.18 58.32,44.81 46.67,44.81 45.52,45.96 43.03,45.96 ST_LED4.A | v68.1,33.43 68.1,32.63 68.19,32.54 68.19,29.87 66.14,27.83 66.14,26.76 69.08,23.82 69.79,23.82 U$4.4
  Bottom 0.203: v58.94,44.18 58.94,43.92 68.1,34.76 v68.1,33.43
N$1
  Top 0.813: U$1.14 17.96,31.65 17.96,31.03 6.67,19.74 6.67,13.25 6.49,13.07 JP1.1
N$2  (1 unrouted)
N$3
  Top 0.813: U$1.13 17.96,29.07 17.96,28.45 9.07,19.56 9.07,12.8 JP1.2
N$4
  Top 0.813: U$1.12 17.96,26.49 17.96,25.96 11.56,19.56 11.56,13.07 JP1.3
N$5
  Top 0.813: U$1.11 17.96,24 17.96,23.38 14.13,19.56 14.13,12.8 JP1.4
N$6  (via drill 0.3)
  Top 0.203: v58.94,36.98 58.94,40.09 R_EN.2 | v56.98,29.6 56.98,26.67 57.34,26.31 58.14,26.31 U$4.40
  Bottom 0.203: v58.94,36.98 58.94,31.56 v56.98,29.6
N$7
  Top 0.203: R1.1 35.03,36.09 39.65,36.09 47.65,28.09 49.43,28.09 52.72,24.8 56.9,24.8 57.43,24.27 58.14,24.27 U$4.44
N$8
  Top 0.152: FR1.1 18.05,40.09 18.05,39.2 21.87,35.38 21.87,26.85 23.65,25.07 26.31,25.07 FT232RL.23
N$9
  Top 0.152: FR1.2 18.05,41.87 18.05,43.92 TX.C
N$10
  Top 0.152: FR2.2 21.07,40.09 21.07,36.63 22.23,35.47 22.23,28.18 22.4,28 23.93,28 25,25.7 25.78,25.69 26.31,25.69 FT232RL.22
N$11
  Top 0.152: FR2.1 20.98,41.87 20.98,43.92 RX.C
N$12  (1 unrouted)
  Top 0.203: 55.03,24 56.27,22.76 U$4.47
N$13
  Top 0.152: C_VCCIO.1 23.02,28.89 26.31,28.89 FT232RL.17 26.4,28.89 26.94,28.89 32.09,23.74 33.6,23.74 FT232RL.4
N$14  (via drill 0.3)
  Top 0.203: v41.25,33.69 36.01,33.69 33.6,36.09 R2.1 | v56.45,24.18 56.98,24.18 57.34,23.82 58.14,23.82 U$4.45
  Bottom 0.203: v41.25,33.69 49.52,33.69 56.45,26.76 v56.45,24.18
N$18
  Top 0.152: 3.3_PWR.C 32,15.02 34.94,15.02 LR2.2
N$19
  Top 0.152: LR1.2 26.05,41.96 26.05,43.92 USB_PWR.C
N$21
  Top 0.813: U$3.14 94.94,31.65 94.94,31.03 86.06,22.14 86.06,13.16 JP2.1
N$23
  Top 0.813: U$3.13 94.94,29.07 94.94,28.45 88.54,22.05 88.54,12.89 JP2.2
N$24
  Top 0.813: U$3.12 94.94,26.49 94.94,25.96 91.12,22.14 91.12,13.16 JP2.3
N$25
  Top 0.813: U$3.11 94.94,24 94.94,23.38 93.61,22.05 93.61,12.89 JP2.4
N$41
  Top 0.152: R15.1 55.03,41.96 55.03,43.92 ST_LED1.C
N$43
  Top 0.152: R31.1 51.03,41.96 51.03,43.92 ST_LED2.C
N$45
  Top 0.203: R32.1 47.03,41.96 47.03,43.92 ST_LED3.C
N$47
  Top 0.152: R33.1 43.03,41.96 43.03,43.92 ST_LED4.C
N$122
  Top 0.203: R7.1 73.97,25.07 75.21,25.07 76.19,26.05 Q1.1 76.28,26.14 76.28,26.31 76.99,27.03 76.99,29.07 C16.1
OSC_IN
  Top 0.203: Q1.3 77.79,23.82 77.08,23.11 77.08,20.98 C17.1 76.99,20.8 76.81,20.62 73.7,20.62 72.81,21.51 72.81,21.96 70.59,24.18 69.88,24.18 U$4.5
OSC_OUT
  Top 0.203: R7.2 72.1,24.98 70.76,24.98 70.59,24.8 69.88,24.8 U$4.6
S1_DIR  (via drill 0.3)
  Top 0.203: v60.72,25.6 62.23,25.6 65.7,29.07 65.7,31.74 U$4.21
  Bottom 0.203: v60.72,25.6 57.34,28.98 54.76,28.98 48.45,35.29 31.11,35.29 18.49,22.67 17.42,22.67 17.34,22.76 9.07,22.76 5.33,19.02 U$1.8
S1_M0  (via drill 0.3)
  Top 0.203: v67.74,26.94 67.74,27.83 69.16,29.25 69.79,29.25 U$4.15 | v58.14,20.98 56.81,20.98 55.47,19.65 41.07,19.65 v32.89,11.47 | v31.91,10.49 5.69,10.49 3.47,12.71 3.47,32.36 5.25,34.14 U$1.2
  Bottom 0.203: v67.74,26.94 61.78,20.98 v58.14,20.98 | v31.91,10.49 v32.89,11.47
S1_M1  (via drill 0.3)
  Top 0.203: v67.12,27.47 67.12,27.74 69.08,29.69 69.79,29.69 U$4.16 | v30.49,11.11 5.6,11.11 3.82,12.89 3.82,30.23 5.25,31.65 U$1.3
  Bottom 0.203: v67.12,27.47 67.12,27.03 62.14,22.05 55.56,22.05 39.92,6.4 35.92,6.4 35.74,6.22 35.38,6.22 v30.49,11.11
S1_STEP  (via drill 0.3)
  Top 0.203: v64.1,33.52 65.25,33.52 66.23,32.54 66.23,31.83 U$4.20 | v61.25,36.36 40.18,36.36 v40.01,36.54
  Bottom 0.203: v61.25,36.36 v64.1,33.52 | v40.01,36.54 39.12,35.65 26.4,35.65 18.67,27.91 17.42,27.91 12.62,23.11 6.93,23.11 5.33,21.51 U$1.7
S2_DIR
  Top 0.203: U$4.25 63.74,31.83 63.74,32.54 63.21,33.07 62.05,33.07 61.78,33.34 61.78,36.09 64.63,38.94 82.77,38.94 84.19,37.52 84.19,20.89 82.32,19.02 U$3.8
S2_M0  (via drill 0.3)
  Top 0.203: v75.65,27.56 74.41,26.31 69.88,26.31 U$4.9
  Bottom 0.203: v75.65,27.56 75.65,28.27 80.63,33.25 81.34,33.25 82.23,34.14 U$3.2
S2_M1  (via drill 0.3)
  Top 0.203: v76.36,28.18 75.48,28.18 74.05,26.76 69.88,26.76 U$4.10
  Bottom 0.203: v76.36,28.18 78.85,28.18 82.32,31.65 U$3.3
S2_STEP
  Top 0.203: U$4.24 64.19,31.83 64.19,32.63 63.39,33.43 62.23,33.43 62.14,33.52 62.14,34.67 62.67,35.2 71.92,35.2 75.3,38.58 82.59,38.58 83.83,37.34 83.83,23.02 82.32,21.51 U$3.7
SWCLK
  Top 0.203: U$4.49 60.19,20.18 60.19,15.73 55.65,11.2 55.65,10.05 59.83,5.87 62.67,5.87 65.08,3.47 74.41,3.47 75.65,4.71 U$2.9
SWDIO
  Top 0.203: U$4.46 58.23,23.2 58.94,23.2 59.56,22.58 59.56,15.65 55.3,11.38 55.3,7.38 57.7,4.98 57.7,4.36 58.94,3.11 75.83,3.11 76.99,4.27 76.99,5.25 76.28,5.96 74.41,5.96 73.25,4.8 U$2.7
SWO  (via drill 0.3)
  Top 0.203: v66.67,21.34 66.59,21.34 65.96,21.96 64.01,21.96 63.3,21.25 63.3,20.27 U$4.55 | v70.05,18.67 70.05,15.65 77.17,8.53 78.77,8.53 79.57,7.73 79.57,5.96 80.72,4.8 U$2.13
  Bottom 0.203: v66.67,21.34 67.39,21.34 v70.05,18.67
UART3_RX  (via drill 0.3)
  Top 0.203: v43.47,33.07 44.27,33.87 59.92,33.87 61.16,32.63 61.16,31.83 U$4.30 | v42.67,32.27 40.01,32.27 35.03,27.29 35.03,22.49 34.31,21.78 33.69,21.78 FT232RL.1
  Bottom 0.203: v42.67,32.27 v43.47,33.07
UART3_TX  (via drill 0.3)
  Top 0.203: v41.87,34.67 59.65,34.67 61.7,32.63 61.7,31.83 U$4.29 | v39.83,33.07 39.83,32.63 34.67,27.47 34.67,24.8 34.31,24.45 33.69,24.45 FT232RL.5
  Bottom 0.203: v41.87,34.67 41.52,34.31 41.07,34.31 v39.83,33.07
USB_D+
  Top 0.152: P1.3 32.98,44.27 32.98,43.65 32,42.67 32,40.54 VCP_DP.2 31.91,40.45 31.56,40.45 26.4,35.29 26.4,30.23 FT232RL.15
USB_D-
  Top 0.152: P1.2 33.69,44.27 33.69,43.65 34.94,42.41 34.94,40.54 VCP_DM.2 34.94,40.45 34.58,40.45 34.05,39.92 34.05,38.58 32.72,37.25 31.74,37.25 31.11,36.63 31.11,33.78 26.94,29.6 26.4,29.6 FT232RL.16
USB_DM
  Top 0.203: R1.2 35.03,37.96 35.03,39.47 VCP_DM.1
USB_DP
  Top 0.203: R2.2 32,37.96 32,39.47 VCP_DP.1

### Text on the board
tNames: MPU-9250
bNames: ELEC3907 / GROUP FOXTROT / WINTER 2016